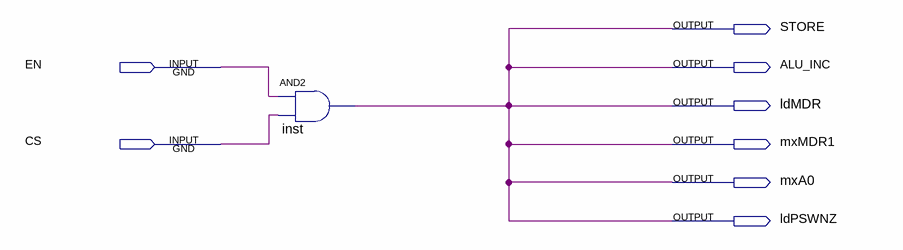
[diagram p0: schematic sheet]
// Quartus schematic DEC.bdf as structural Verilog: 1 symbols, 8 pins
module DEC (
  input  EN,
  input  CS,
  output STORE,
  output ALU_INC,
  output ldMDR,
  output mxMDR1,
  output mxA0,
  output ldPSWNZ
);

  and inst (ALU_INC, EN, CS);

  assign ldMDR = ALU_INC;
  assign ldPSWNZ = ALU_INC;
  assign mxA0 = ALU_INC;
  assign mxMDR1 = ALU_INC;
  assign STORE = ALU_INC;
endmodule
